# Altium schematic sheet Port Expander.SchDoc
size A4; DocumentNumber: 5; SheetNumber: 5; SheetTotal: 8
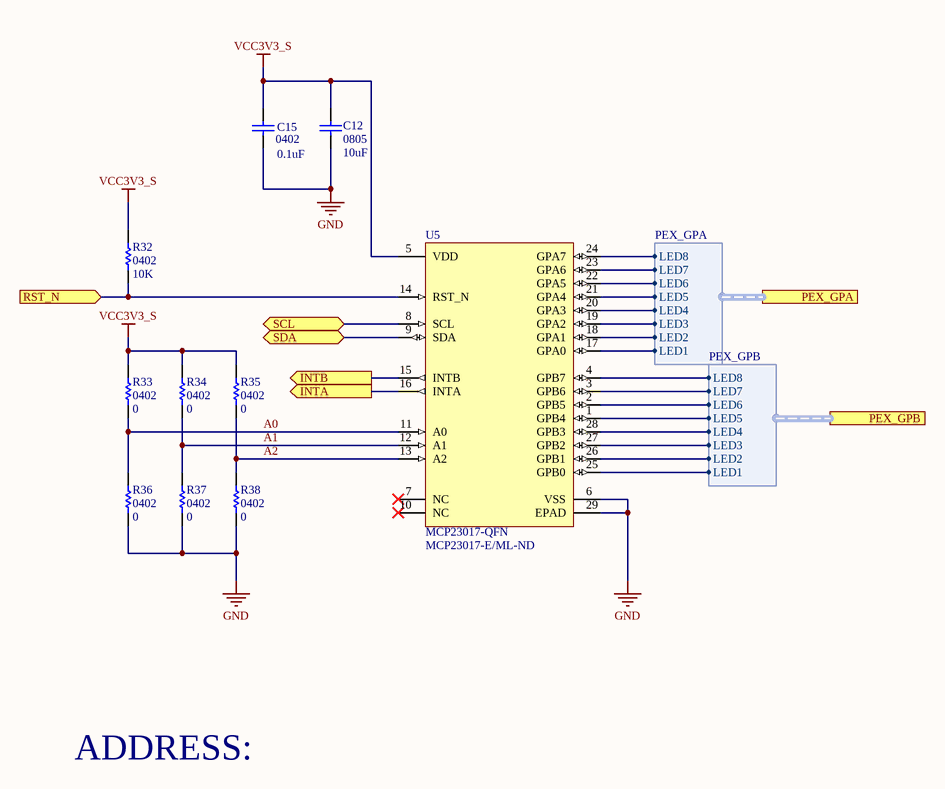
[diagram p0: Port Expander.SchDoc]

## Parts
C12  0805  value 10uF  [CAP0805R]
C15  0402  value 0.1uF  [CAP0402R]
R32  0402  value 10K  [RES0402R]
R33  0402  value 0  [RES0402R]
R34  0402  value 0  [RES0402R]
R35  0402  value 0  [RES0402R]
R36  0402  value 0  [RES0402R]
R37  0402  value 0  [RES0402R]
R38  0402  value 0  [RES0402R]
U5  MCP23017-QFN  Supplier Part Number 1: MCP23017-E/ML-ND  [QFN65P600X600X100-29]

## Ports
INTA (out), INTB (out), PEX_GPA (harness PEX_GPA), PEX_GPB (harness PEX_GPB), RST_N (in), SCL (bidir), SDA (bidir)

## Harnesses
PEX_GPA: LED1, LED2, LED3, LED4, LED5, LED6, LED7, LED8
PEX_GPB: LED1, LED2, LED3, LED4, LED5, LED6, LED7, LED8

## Nets
GND: C12.1 C15.1 R36.1 R37.1 R38.1 U5.6(VSS) U5.29(EPAD)
VCC3V3_S: C12.2 C15.2 R32.2 R33.2 R34.2 R35.2 U5.5(VDD)
A0: R33.1 R36.2 U5.11(A0)
A1: R34.1 R37.2 U5.12(A1)
A2: R35.1 R38.2 U5.13(A2)
INTA: U5.16(INTA) ; port INTA
INTB: U5.15(INTB) ; port INTB
RST_N: R32.1 U5.14(RST_N) ; port RST_N
SCL: U5.8(SCL) ; port SCL
SDA: U5.9(SDA) ; port SDA
NetU5_1: U5.1(GPB4) ; port PEX_GPB.LED5
NetU5_2: U5.2(GPB5) ; port PEX_GPB.LED6
NetU5_3: U5.3(GPB6) ; port PEX_GPB.LED7
NetU5_4: U5.4(GPB7) ; port PEX_GPB.LED8
NetU5_17: U5.17(GPA0) ; port PEX_GPA.LED1
NetU5_18: U5.18(GPA1) ; port PEX_GPA.LED2
NetU5_19: U5.19(GPA2) ; port PEX_GPA.LED3
NetU5_20: U5.20(GPA3) ; port PEX_GPA.LED4
NetU5_21: U5.21(GPA4) ; port PEX_GPA.LED5
NetU5_22: U5.22(GPA5) ; port PEX_GPA.LED6
NetU5_23: U5.23(GPA6) ; port PEX_GPA.LED7
NetU5_24: U5.24(GPA7) ; port PEX_GPA.LED8
NetU5_25: U5.25(GPB0) ; port PEX_GPB.LED1
NetU5_26: U5.26(GPB1) ; port PEX_GPB.LED2
NetU5_27: U5.27(GPB2) ; port PEX_GPB.LED3
NetU5_28: U5.28(GPB3) ; port PEX_GPB.LED4

Not connected (* = marked no-connect by the designer): U5 7(NC)* 10(NC)*

## Notes on the sheet
- ADDRESS:

## Library data of the parts
C12 = Cap: Capacitor; Manufacturer: TDK; Manufacturer Part Number: CGA4J1X7R0J106K125AC; Voltage Rating: 6.3V; Tolerance: 10%; Dielectric: X7R; Published: 8-Jun-2000; LatestRevisionDate: 17-Jul-2002; LatestRevisionNote: Re-released for DXP Platform.; PackageReference: RAD-0.3; Publisher: Altium Limited; PackageDescription: Radial Cap, Thru-Hole; 2 Leads; 0.3 in Pin Spacing; Supplier 1: Digi-Key; Supplier Part Number 1: 445-6971-1-ND; Stock 1: 793917; Pricing 1: 1=0.48, 10=0.331, 100=0.1984, 500=0.14878, 1000=0.12564 (USD); Mount: Surface Mount; Case/Package: 0805; Weight: 0.000194oz; Case Code (Metric): 2012; Case Code (Imperial): 0805; Min Operating Temperature: -55°C; Max Operating Temperature: 125°C; Package Quantity: 1; Capacitance: 10uF; Packaging: Tape and Reel; Voltage Rating (DC): 6.3V; Termination: SMD/SMT; Composition: Ceramic; Length: 2mm; Height: 1.25mm; Width: 0.049inch; Thickness: 0.057inch; Depth: 1.25mm; Ratings: AEC-Q200; REACH SVHC: No SVHC; Lead Free: Lead Free; ComponentLink1URL: http://www.farnell.com/datasheets/1807242.pdf?src-supplier=Element14; ComponentLink1Description: http://www.farnell.com/datasheets/1807242.pdf?src-supplier=Element14; ComponentLink2URL: http://product.tdk.com/capacitor/mlcc/detailed_information.php?lang=en&amp;ref=jp&amp;part_no=CGA4J1X7R0J106K125AC&src-supplier=Mouser; ComponentLink2Description: http://product.tdk.com/capacitor/mlcc/detailed_information.php?lang=en&amp;ref=jp&amp;part_no=CGA4J1X7R0J106K125AC&src-supplier=Mouser
C15 = Cap Semi: Capacitor (Semiconductor SIM Model); Manufacturer: Murata; Manufacturer Part Number: GCM155R71C104KA55J; Capacitance: 100nF; Tolerance: 10%; Voltage Rating: 16V; Dielectric: X7R; Published: 8-Jun-2000; LatestRevisionDate: 29-May-2009; LatestRevisionNote: IPC-7351 Footprint Added.; PackageReference: C1206; Publisher: Altium Limited; PackageDescription: Chip Capacitor; Supplier 1: Digi-Key; Supplier Part Number 1: 587-3807-1-ND; Supplier 2: Digi-Key; Supplier Part Number 2: 490-7998-1-ND; Stock 2: 5962647; Pricing 2: 1=0.1, 10=0.058, 100=0.026, 500=0.01858, 1000=0.0146, 2500=0.01328, 5000=0.01221 (USD); Mount: Surface Mount; Case/Package: 0402; Case Code (Imperial): 0402; Case Code (Metric): 1005; Min Operating Temperature: -55°C; Max Operating Temperature: 125°C; Voltage Rating (DC): 16V; Packaging: Tape and Reel; Package Quantity: 1; Termination: SMD/SMT; Length: 1mm; Height: 0.5mm; Width: 0.5mm; Thickness: 0.022inch; Depth: 0.5mm; Ratings: AEC-Q200; Radiation Hardening: No; Lead Free: Lead Free; ComponentLink1URL: http://psearch.murata.com/capacitor/product/GCM155R71C104KA55%23.pdf?src-supplier=Avnet; ComponentLink1Description: http://psearch.murata.com/capacitor/product/GCM155R71C104KA55%23.pdf?src-supplier=Avnet; ComponentLink2URL: http://www1.futureelectronics.com/doc/MURATA/GCM155R71C104KA55J.pdf?src-supplier=Future+Electronics; ComponentLink2Description: http://www1.futureelectronics.com/doc/MURATA/GCM155R71C104KA55J.pdf?src-supplier=Future+Electronics; ComponentLink3URL: http://psearch.en.murata.com/capacitor/product/GCM155R71C104KA55%23.pdf?src-supplier=Digi-Key; ComponentLink3Description: http://psearch.en.murata.com/capacitor/product/GCM155R71C104KA55%23.pdf?src-supplier=Digi-Key; ComponentLink4URL: http://search.murata.co.jp/Ceramy/image/img/A01X/partnumbering_e_02.pdf?src-supplier=Digi-Key; ComponentLink4Description: http://search.murata.co.jp/Ceramy/image/img/A01X/partnumbering_e_02.pdf?src-supplier=Digi-Key
R32 = Res1: Resistor; Published: 8-Jun-2000; LatestRevisionDate: 17-Jul-2002; LatestRevisionNote: Re-released for DXP Platform.; PackageReference: AXIAL-0.3; Publisher: Altium Limited; PackageDescription: Axial Device, Thru-Hole; 2 Leads; 0.3 in Pin Spacing; Supplier 1: Digi-Key
R33-R38 = Res1: Resistor; Manufacturer: Panasonic; Manufacturer Part Number: ERJ2GE0R00X; Resistance: 0mR; Power Rating: 100mW; Voltage Rating: 50V; Tolerance: 5%; Temperature Coefficient: 600ppm/°C; Published: 8-Jun-2000; LatestRevisionDate: 17-Jul-2002; LatestRevisionNote: Re-released for DXP Platform.; PackageReference: AXIAL-0.3; Publisher: Altium Limited; PackageDescription: Axial Device, Thru-Hole; 2 Leads; 0.3 in Pin Spacing; Supplier 1: Digi-Key; Supplier 2: Digi-Key; Supplier Part Number 2: P0.0JCT-ND; Stock 2: 51531353; Pricing 2: 1=0.1, 10=0.03, 25=0.0216, 50=0.0164, 100=0.0121, 250=0.00924, 500=0.0074, 1000=0.00545, 5000=0.00391 (USD); Mount: Surface Mount; Case/Package: 0402; Case Code (Metric): 1005; Case Code (Imperial): 0402; Contact Plating: Tin; Min Operating Temperature: -55°C; Max Operating Temperature: 155°C; Packaging: Tape and Reel; Package Quantity: 1; Composition: Thick Film; Number of Terminations: 2; Termination: SMD/SMT; Military Standard: Not; Max Power Dissipation: 100mW; Voltage Rating (DC): 50V; Features: Automotive AEC-Q200; Length: 1mm; Height: 0.35mm; Width: 0.02inch; Depth: 0.5mm; Radiation Hardening: No; REACH SVHC: No SVHC; Lead Free: Lead Free; ComponentLink1URL: http://industrial.panasonic.com/www-data/pdf/AOA0000/AOA0000CE1.pdf?src-supplier=Avnet; ComponentLink1Description: http://industrial.panasonic.com/www-data/pdf/AOA0000/AOA0000CE1.pdf?src-supplier=Avnet; ComponentLink2URL: http://www.alliedelec.com/m/d/51cd0790071e1666bdb9d00c57fcf960.pdf?src-supplier=Allied+Electronics; ComponentLink2Description: http://www.alliedelec.com/m/d/51cd0790071e1666bdb9d00c57fcf960.pdf?src-supplier=Allied+Electronics; ComponentLink3URL: http://industrial.panasonic.com/www-data/pdf/AOA0000/AOA0000CE1.pdf?src-supplier=Avnet+Europe; ComponentLink3Description: http://industrial.panasonic.com/www-data/pdf/AOA0000/AOA0000CE1.pdf?src-supplier=Avnet+Europe; ComponentLink4URL: http://www.farnell.com/datasheets/2059623.pdf?src-supplier=Farnell; ComponentLink4Description: http://www.farnell.com/datasheets/2059623.pdf?src-supplier=Farnell; ComponentLink5URL: http://www.farnell.com/datasheets/1678796.pdf?src-supplier=Element14; ComponentLink5Description: http://www.farnell.com/datasheets/1678796.pdf?src-supplier=Element14; ComponentLink6URL: http://www.farnell.com/datasheets/2059623.pdf?src-supplier=Element14; ComponentLink6Description: http://www.farnell.com/datasheets/2059623.pdf?src-supplier=Element14
U5 = MCP23017-QFN: Supplier 1: Digi-Key